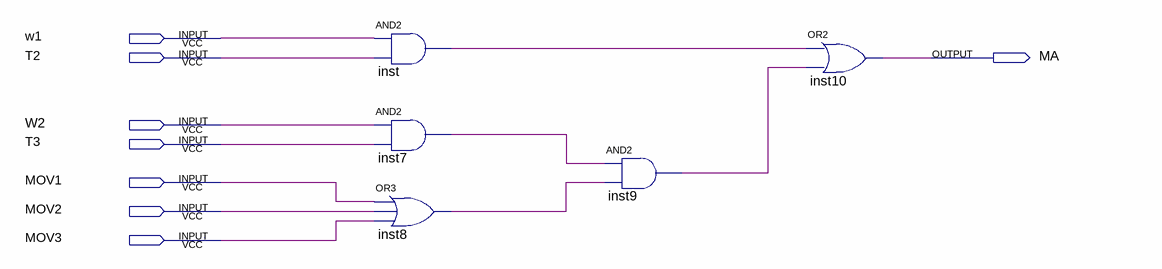
[diagram p0: schematic sheet]
// Quartus schematic MA.bdf as structural Verilog: 5 symbols, 8 pins
module MA (
  input  w1,
  input  T2,
  input  W2,
  input  T3,
  input  MOV1,
  input  MOV2,
  input  MOV3,
  output MA
);

  wire inst7_out, inst8_out, inst9_out, inst_out;

  and inst (inst_out, w1, T2);
  and inst7 (inst7_out, W2, T3);
  or inst8 (inst8_out, MOV1, MOV2, MOV3);
  and inst9 (inst9_out, inst7_out, inst8_out);
  or inst10 (MA, inst_out, inst9_out);
endmodule
